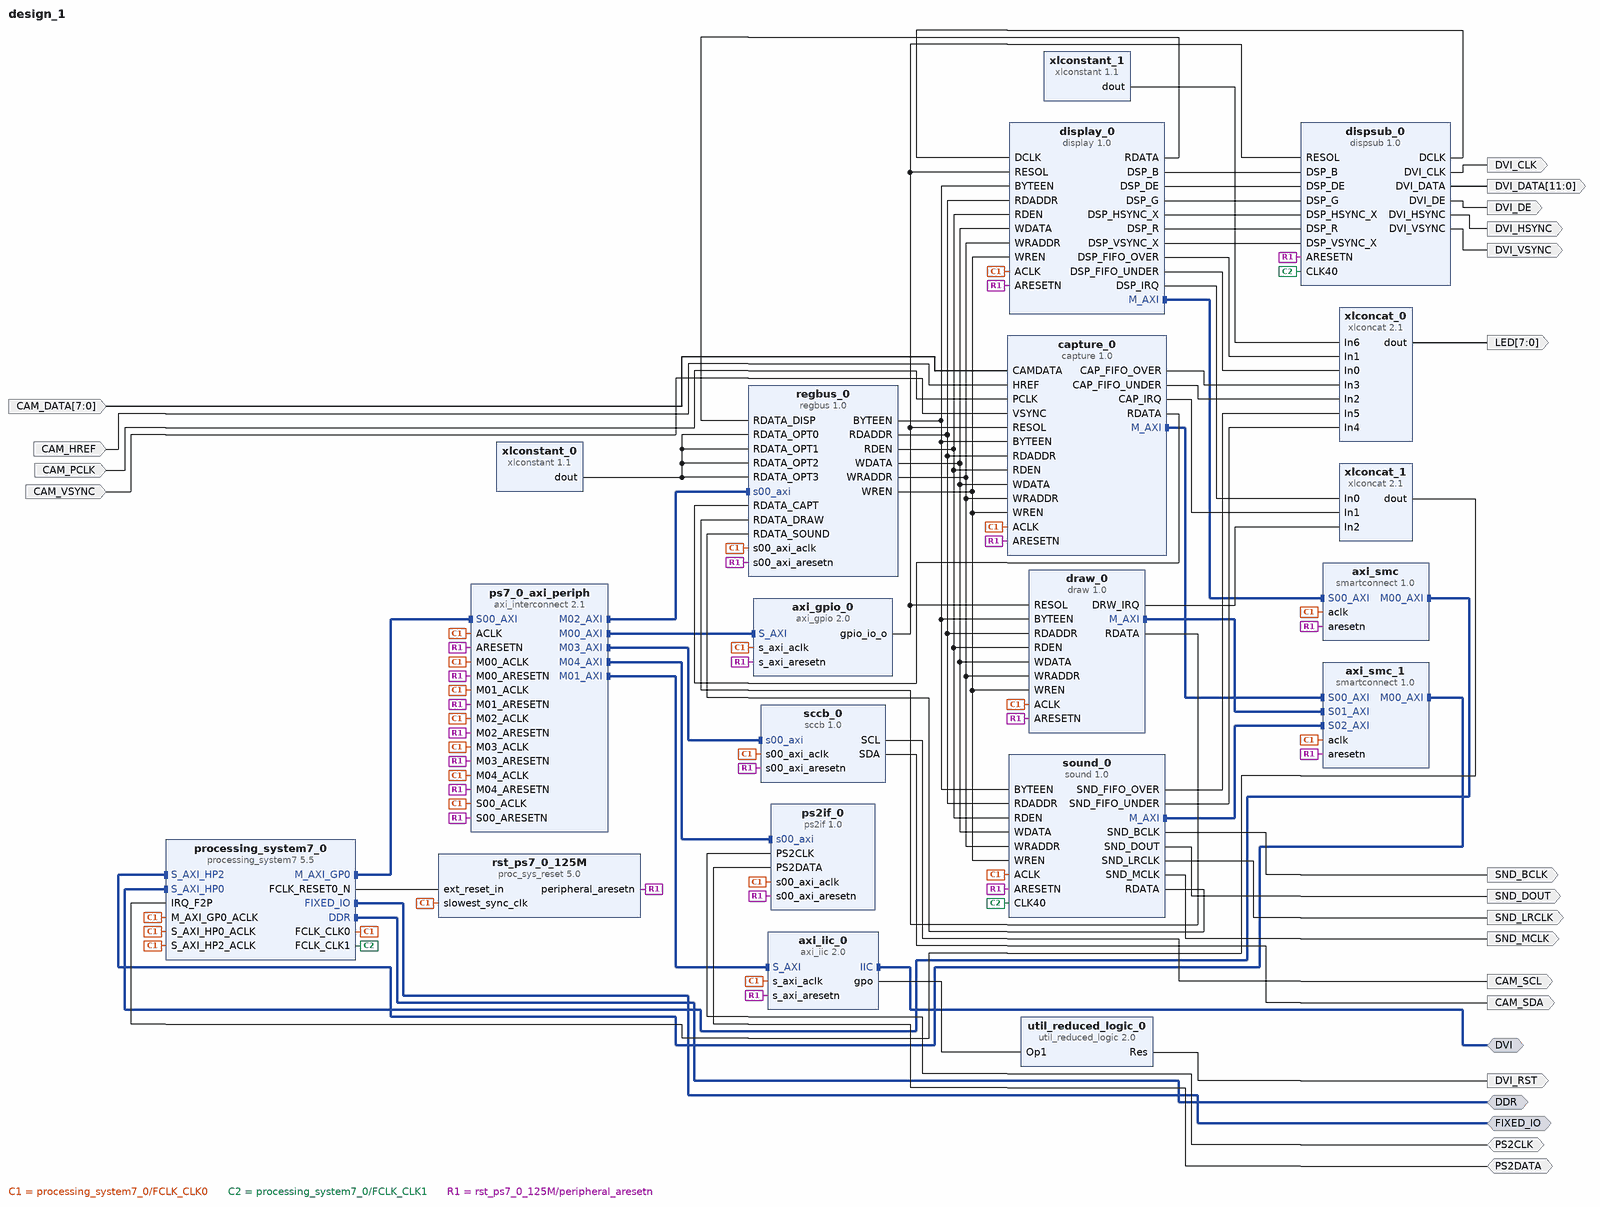
[diagram p0: block diagram of the top level]
# Vivado block design design_1, xc7z020clg484-1, Vivado 2019.1
create_bd_design design_1

create_bd_intf_port -mode Master -vlnv xilinx.com:interface:ddrx_rtl:1.0 DDR
create_bd_intf_port -mode Master -vlnv xilinx.com:interface:iic_rtl:1.0 DVI
create_bd_intf_port -mode Master -vlnv xilinx.com:display_processing_system7:fixedio_rtl:1.0 FIXED_IO
create_bd_port -dir I -from 7 -to 0 CAM_DATA
create_bd_port -dir I CAM_HREF
create_bd_port -dir I CAM_PCLK
create_bd_port -dir O CAM_SCL
create_bd_port -dir O CAM_SDA
create_bd_port -dir I CAM_VSYNC
create_bd_port -dir O DVI_CLK
create_bd_port -dir O -from 11 -to 0 DVI_DATA
create_bd_port -dir O DVI_DE
create_bd_port -dir O DVI_HSYNC
create_bd_port -dir O DVI_RST
create_bd_port -dir O DVI_VSYNC
create_bd_port -dir O -from 7 -to 0 LED
create_bd_port -dir IO PS2CLK
create_bd_port -dir IO PS2DATA
create_bd_port -dir O SND_BCLK
create_bd_port -dir O SND_DOUT
create_bd_port -dir O SND_LRCLK
create_bd_port -dir O SND_MCLK

create_bd_cell -type ip -vlnv xilinx.com:ip:axi_gpio:2.0 axi_gpio_0
set_property -dict {CONFIG.C_ALL_OUTPUTS 1 CONFIG.C_GPIO_WIDTH 2} [get_bd_cells axi_gpio_0]
create_bd_cell -type ip -vlnv xilinx.com:ip:axi_iic:2.0 axi_iic_0
create_bd_cell -type ip -vlnv xilinx.com:ip:smartconnect:1.0 axi_smc
set_property -dict {CONFIG.NUM_SI 1} [get_bd_cells axi_smc]
create_bd_cell -type ip -vlnv xilinx.com:ip:smartconnect:1.0 axi_smc_1
set_property -dict {CONFIG.NUM_SI 3} [get_bd_cells axi_smc_1]
create_bd_cell -type ip -vlnv xilinx.com:user:display:1.0 display_0
create_bd_cell -type ip -vlnv xilinx.com:user:dispsub:1.0 dispsub_0
create_bd_cell -type ip -vlnv xilinx.com:ip:processing_system7:5.5 processing_system7_0
set_property -dict [list \
  CONFIG.PCW_APU_PERIPHERAL_FREQMHZ 666.666666 \
  CONFIG.PCW_CAN0_CAN0_IO {MIO 46 .. 47} \
  CONFIG.PCW_CAN0_PERIPHERAL_ENABLE 1 \
  CONFIG.PCW_CAN_PERIPHERAL_FREQMHZ 23.8095 \
  CONFIG.PCW_ENET0_ENET0_IO {MIO 16 .. 27} \
  CONFIG.PCW_ENET0_GRP_MDIO_ENABLE 1 \
  CONFIG.PCW_ENET0_GRP_MDIO_IO {MIO 52 .. 53} \
  CONFIG.PCW_ENET0_PERIPHERAL_ENABLE 1 \
  CONFIG.PCW_ENET0_PERIPHERAL_FREQMHZ {100 Mbps} \
  CONFIG.PCW_ENET0_RESET_ENABLE 1 \
  CONFIG.PCW_ENET0_RESET_IO {MIO 11} \
  CONFIG.PCW_ENET_RESET_ENABLE 1 \
  CONFIG.PCW_ENET_RESET_SELECT {Share reset pin} \
  CONFIG.PCW_EN_CLK1_PORT 1 \
  CONFIG.PCW_FCLK_CLK1_BUF TRUE \
  CONFIG.PCW_FPGA0_PERIPHERAL_FREQMHZ 125 \
  CONFIG.PCW_FPGA1_PERIPHERAL_FREQMHZ 40 \
  CONFIG.PCW_FPGA_FCLK1_ENABLE 1 \
  CONFIG.PCW_GPIO_MIO_GPIO_ENABLE 1 \
  CONFIG.PCW_GPIO_MIO_GPIO_IO MIO \
  CONFIG.PCW_I2C0_GRP_INT_ENABLE 0 \
  CONFIG.PCW_I2C0_I2C0_IO {MIO 50 .. 51} \
  CONFIG.PCW_I2C0_PERIPHERAL_ENABLE 1 \
  CONFIG.PCW_I2C0_RESET_ENABLE 1 \
  CONFIG.PCW_I2C0_RESET_IO {MIO 13} \
  CONFIG.PCW_I2C_PERIPHERAL_FREQMHZ 111.111115 \
  CONFIG.PCW_I2C_RESET_ENABLE 1 \
  CONFIG.PCW_I2C_RESET_SELECT {Share reset pin} \
  CONFIG.PCW_IRQ_F2P_INTR 1 \
  CONFIG.PCW_PRESET_BANK0_VOLTAGE {LVCMOS 1.8V} \
  CONFIG.PCW_PRESET_BANK1_VOLTAGE {LVCMOS 1.8V} \
  CONFIG.PCW_QSPI_GRP_FBCLK_ENABLE 1 \
  CONFIG.PCW_QSPI_GRP_FBCLK_IO {MIO 8} \
  CONFIG.PCW_QSPI_GRP_SINGLE_SS_ENABLE 1 \
  CONFIG.PCW_QSPI_GRP_SINGLE_SS_IO {MIO 1 .. 6} \
  CONFIG.PCW_QSPI_PERIPHERAL_ENABLE 1 \
  CONFIG.PCW_QSPI_QSPI_IO {MIO 1 .. 6} \
  CONFIG.PCW_SD0_GRP_CD_ENABLE 1 \
  CONFIG.PCW_SD0_GRP_CD_IO {MIO 0} \
  CONFIG.PCW_SD0_GRP_WP_ENABLE 1 \
  CONFIG.PCW_SD0_GRP_WP_IO {MIO 15} \
  CONFIG.PCW_SD0_PERIPHERAL_ENABLE 1 \
  CONFIG.PCW_SD0_SD0_IO {MIO 40 .. 45} \
  CONFIG.PCW_SDIO_PERIPHERAL_FREQMHZ 50 \
  CONFIG.PCW_SINGLE_QSPI_DATA_MODE x4 \
  CONFIG.PCW_TTC0_PERIPHERAL_ENABLE 1 \
  CONFIG.PCW_TTC0_TTC0_IO EMIO \
  CONFIG.PCW_UART1_PERIPHERAL_ENABLE 1 \
  CONFIG.PCW_UART1_UART1_IO {MIO 48 .. 49} \
  CONFIG.PCW_UART_PERIPHERAL_FREQMHZ 50 \
  CONFIG.PCW_UIPARAM_DDR_FREQ_MHZ 533.333333 \
  CONFIG.PCW_UIPARAM_DDR_PARTNO {MT41J256M8 HX-15E} \
  CONFIG.PCW_USB0_PERIPHERAL_ENABLE 1 \
  CONFIG.PCW_USB0_RESET_ENABLE 1 \
  CONFIG.PCW_USB0_RESET_IO {MIO 7} \
  CONFIG.PCW_USB0_USB0_IO {MIO 28 .. 39} \
  CONFIG.PCW_USB_RESET_ENABLE 1 \
  CONFIG.PCW_USB_RESET_SELECT {Share reset pin} \
  CONFIG.PCW_USE_FABRIC_INTERRUPT 1 \
  CONFIG.PCW_USE_S_AXI_HP0 1 \
  CONFIG.PCW_USE_S_AXI_HP2 1 \
  CONFIG.preset ZC702 \
] [get_bd_cells processing_system7_0]
# 222 more settings of processing_system7_0 are not shown: defaults, MIO pin electricals, DDR timing, and values the tool derives
create_bd_cell -type ip -vlnv xilinx.com:user:ps2if:1.0 ps2if_0
create_bd_cell -type ip -vlnv xilinx.com:ip:axi_interconnect:2.1 ps7_0_axi_periph
set_property -dict {CONFIG.NUM_MI 5} [get_bd_cells ps7_0_axi_periph]
create_bd_cell -type ip -vlnv xilinx.com:user:regbus:1.0 regbus_0
create_bd_cell -type ip -vlnv xilinx.com:ip:proc_sys_reset:5.0 rst_ps7_0_125M
create_bd_cell -type ip -vlnv xilinx.com:user:sccb:1.0 sccb_0
create_bd_cell -type ip -vlnv xilinx.com:ip:util_reduced_logic:2.0 util_reduced_logic_0
set_property -dict {CONFIG.C_SIZE 1} [get_bd_cells util_reduced_logic_0]
create_bd_cell -type ip -vlnv xilinx.com:ip:xlconcat:2.1 xlconcat_0
set_property -dict {CONFIG.IN4_WIDTH 1 CONFIG.IN6_WIDTH 2 CONFIG.NUM_PORTS 7} [get_bd_cells xlconcat_0]
create_bd_cell -type ip -vlnv xilinx.com:ip:xlconcat:2.1 xlconcat_1
set_property -dict {CONFIG.NUM_PORTS 3} [get_bd_cells xlconcat_1]
create_bd_cell -type ip -vlnv xilinx.com:ip:xlconstant:1.1 xlconstant_0
set_property -dict {CONFIG.CONST_VAL 0 CONFIG.CONST_WIDTH 32} [get_bd_cells xlconstant_0]
create_bd_cell -type ip -vlnv xilinx.com:ip:xlconstant:1.1 xlconstant_1
set_property -dict {CONFIG.CONST_VAL 0 CONFIG.CONST_WIDTH 2} [get_bd_cells xlconstant_1]
create_bd_cell -type ip -vlnv xilinx.com:user:capture:1.0 capture_0
create_bd_cell -type ip -vlnv xilinx.com:user:sound:1.0 sound_0
create_bd_cell -type ip -vlnv xilinx.com:user:draw:1.0 draw_0

# ---- connections ----

connect_bd_intf_net [get_bd_intf_pins ps2if_0/s00_axi] [get_bd_intf_pins ps7_0_axi_periph/M04_AXI]
connect_bd_intf_net [get_bd_intf_ports DVI] [get_bd_intf_pins axi_iic_0/IIC]
connect_bd_intf_net [get_bd_intf_pins axi_smc_1/S00_AXI] [get_bd_intf_pins capture_0/M_AXI]
connect_bd_intf_net [get_bd_intf_ports FIXED_IO] [get_bd_intf_pins processing_system7_0/FIXED_IO]
connect_bd_intf_net [get_bd_intf_pins ps7_0_axi_periph/M02_AXI] [get_bd_intf_pins regbus_0/s00_axi]
connect_bd_intf_net [get_bd_intf_pins processing_system7_0/M_AXI_GP0] [get_bd_intf_pins ps7_0_axi_periph/S00_AXI]
connect_bd_intf_net [get_bd_intf_pins axi_smc_1/M00_AXI] [get_bd_intf_pins processing_system7_0/S_AXI_HP2]
connect_bd_intf_net [get_bd_intf_pins ps7_0_axi_periph/M03_AXI] [get_bd_intf_pins sccb_0/s00_axi]
connect_bd_intf_net [get_bd_intf_ports DDR] [get_bd_intf_pins processing_system7_0/DDR]
connect_bd_intf_net [get_bd_intf_pins axi_smc/S00_AXI] [get_bd_intf_pins display_0/M_AXI]
connect_bd_intf_net [get_bd_intf_pins axi_smc/M00_AXI] [get_bd_intf_pins processing_system7_0/S_AXI_HP0]
connect_bd_intf_net [get_bd_intf_pins axi_smc_1/S02_AXI] [get_bd_intf_pins sound_0/M_AXI]
connect_bd_intf_net [get_bd_intf_pins axi_gpio_0/S_AXI] [get_bd_intf_pins ps7_0_axi_periph/M00_AXI]
connect_bd_intf_net [get_bd_intf_pins axi_smc_1/S01_AXI] [get_bd_intf_pins draw_0/M_AXI]
connect_bd_intf_net [get_bd_intf_pins axi_iic_0/S_AXI] [get_bd_intf_pins ps7_0_axi_periph/M01_AXI]
connect_bd_net -net CAMDATA_0_1 [get_bd_ports CAM_DATA] [get_bd_pins capture_0/CAMDATA]
connect_bd_net -net HREF_0_1 [get_bd_ports CAM_HREF] [get_bd_pins capture_0/HREF]
connect_bd_net [get_bd_ports PS2CLK] [get_bd_pins ps2if_0/PS2CLK]
connect_bd_net [get_bd_ports PS2DATA] [get_bd_pins ps2if_0/PS2DATA]
connect_bd_net -net PCLK_0_1 [get_bd_ports CAM_PCLK] [get_bd_pins capture_0/PCLK]
connect_bd_net -net VSYNC_0_1 [get_bd_ports CAM_VSYNC] [get_bd_pins capture_0/VSYNC]
connect_bd_net [get_bd_pins axi_gpio_0/gpio_io_o] \
  [get_bd_pins display_0/RESOL] [get_bd_pins dispsub_0/RESOL] [get_bd_pins capture_0/RESOL] [get_bd_pins draw_0/RESOL]
connect_bd_net [get_bd_pins axi_iic_0/gpo] [get_bd_pins util_reduced_logic_0/Op1]
connect_bd_net [get_bd_pins capture_0/CAP_FIFO_OVER] [get_bd_pins xlconcat_0/In3]
connect_bd_net [get_bd_pins capture_0/CAP_FIFO_UNDER] [get_bd_pins xlconcat_0/In2]
connect_bd_net [get_bd_pins capture_0/CAP_IRQ] [get_bd_pins xlconcat_1/In1]
connect_bd_net [get_bd_pins capture_0/RDATA] [get_bd_pins regbus_0/RDATA_CAPT]
connect_bd_net [get_bd_pins display_0/DSP_B] [get_bd_pins dispsub_0/DSP_B]
connect_bd_net [get_bd_pins display_0/DSP_DE] [get_bd_pins dispsub_0/DSP_DE]
connect_bd_net [get_bd_pins display_0/DSP_FIFO_OVER] [get_bd_pins xlconcat_0/In1]
connect_bd_net [get_bd_pins display_0/DSP_FIFO_UNDER] [get_bd_pins xlconcat_0/In0]
connect_bd_net [get_bd_pins display_0/DSP_G] [get_bd_pins dispsub_0/DSP_G]
connect_bd_net [get_bd_pins display_0/DSP_HSYNC_X] [get_bd_pins dispsub_0/DSP_HSYNC_X]
connect_bd_net [get_bd_pins display_0/DSP_IRQ] [get_bd_pins xlconcat_1/In0]
connect_bd_net [get_bd_pins display_0/DSP_R] [get_bd_pins dispsub_0/DSP_R]
connect_bd_net [get_bd_pins display_0/DSP_VSYNC_X] [get_bd_pins dispsub_0/DSP_VSYNC_X]
connect_bd_net [get_bd_pins display_0/RDATA] [get_bd_pins regbus_0/RDATA_DISP]
connect_bd_net [get_bd_pins dispsub_0/DCLK] [get_bd_pins display_0/DCLK]
connect_bd_net [get_bd_pins dispsub_0/DVI_CLK] [get_bd_ports DVI_CLK]
connect_bd_net [get_bd_pins dispsub_0/DVI_DATA] [get_bd_ports DVI_DATA]
connect_bd_net [get_bd_pins dispsub_0/DVI_DE] [get_bd_ports DVI_DE]
connect_bd_net [get_bd_pins dispsub_0/DVI_HSYNC] [get_bd_ports DVI_HSYNC]
connect_bd_net [get_bd_pins dispsub_0/DVI_VSYNC] [get_bd_ports DVI_VSYNC]
connect_bd_net [get_bd_pins draw_0/DRW_IRQ] [get_bd_pins xlconcat_1/In2]
connect_bd_net [get_bd_pins draw_0/RDATA] [get_bd_pins regbus_0/RDATA_DRAW]
connect_bd_net [get_bd_pins processing_system7_0/FCLK_CLK0] \
  [get_bd_pins axi_gpio_0/s_axi_aclk] [get_bd_pins axi_iic_0/s_axi_aclk] [get_bd_pins axi_smc/aclk] \
  [get_bd_pins axi_smc_1/aclk] [get_bd_pins display_0/ACLK] [get_bd_pins processing_system7_0/M_AXI_GP0_ACLK] \
  [get_bd_pins processing_system7_0/S_AXI_HP0_ACLK] [get_bd_pins processing_system7_0/S_AXI_HP2_ACLK] \
  [get_bd_pins ps2if_0/s00_axi_aclk] [get_bd_pins ps7_0_axi_periph/ACLK] [get_bd_pins ps7_0_axi_periph/M00_ACLK] \
  [get_bd_pins ps7_0_axi_periph/M01_ACLK] [get_bd_pins ps7_0_axi_periph/M02_ACLK] [get_bd_pins ps7_0_axi_periph/M03_ACLK] \
  [get_bd_pins ps7_0_axi_periph/M04_ACLK] [get_bd_pins ps7_0_axi_periph/S00_ACLK] [get_bd_pins regbus_0/s00_axi_aclk] \
  [get_bd_pins rst_ps7_0_125M/slowest_sync_clk] [get_bd_pins sccb_0/s00_axi_aclk] [get_bd_pins capture_0/ACLK] \
  [get_bd_pins sound_0/ACLK] [get_bd_pins draw_0/ACLK]
connect_bd_net [get_bd_pins processing_system7_0/FCLK_CLK1] [get_bd_pins dispsub_0/CLK40] [get_bd_pins sound_0/CLK40]
connect_bd_net [get_bd_pins processing_system7_0/FCLK_RESET0_N] [get_bd_pins rst_ps7_0_125M/ext_reset_in]
connect_bd_net [get_bd_pins regbus_0/BYTEEN] \
  [get_bd_pins display_0/BYTEEN] [get_bd_pins capture_0/BYTEEN] [get_bd_pins sound_0/BYTEEN] [get_bd_pins draw_0/BYTEEN]
connect_bd_net [get_bd_pins regbus_0/RDADDR] \
  [get_bd_pins display_0/RDADDR] [get_bd_pins capture_0/RDADDR] [get_bd_pins sound_0/RDADDR] [get_bd_pins draw_0/RDADDR]
connect_bd_net [get_bd_pins regbus_0/RDEN] \
  [get_bd_pins display_0/RDEN] [get_bd_pins capture_0/RDEN] [get_bd_pins sound_0/RDEN] [get_bd_pins draw_0/RDEN]
connect_bd_net [get_bd_pins regbus_0/WDATA] \
  [get_bd_pins display_0/WDATA] [get_bd_pins capture_0/WDATA] [get_bd_pins sound_0/WDATA] [get_bd_pins draw_0/WDATA]
connect_bd_net [get_bd_pins regbus_0/WRADDR] \
  [get_bd_pins display_0/WRADDR] [get_bd_pins capture_0/WRADDR] [get_bd_pins sound_0/WRADDR] [get_bd_pins draw_0/WRADDR]
connect_bd_net [get_bd_pins regbus_0/WREN] \
  [get_bd_pins display_0/WREN] [get_bd_pins capture_0/WREN] [get_bd_pins sound_0/WREN] [get_bd_pins draw_0/WREN]
connect_bd_net [get_bd_pins rst_ps7_0_125M/peripheral_aresetn] \
  [get_bd_pins axi_gpio_0/s_axi_aresetn] [get_bd_pins axi_iic_0/s_axi_aresetn] [get_bd_pins axi_smc/aresetn] \
  [get_bd_pins axi_smc_1/aresetn] [get_bd_pins display_0/ARESETN] [get_bd_pins dispsub_0/ARESETN] \
  [get_bd_pins ps2if_0/s00_axi_aresetn] [get_bd_pins ps7_0_axi_periph/ARESETN] [get_bd_pins ps7_0_axi_periph/M00_ARESETN] \
  [get_bd_pins ps7_0_axi_periph/M01_ARESETN] [get_bd_pins ps7_0_axi_periph/M02_ARESETN] \
  [get_bd_pins ps7_0_axi_periph/M03_ARESETN] [get_bd_pins ps7_0_axi_periph/M04_ARESETN] \
  [get_bd_pins ps7_0_axi_periph/S00_ARESETN] [get_bd_pins regbus_0/s00_axi_aresetn] [get_bd_pins sccb_0/s00_axi_aresetn] \
  [get_bd_pins capture_0/ARESETN] [get_bd_pins sound_0/ARESETN] [get_bd_pins draw_0/ARESETN]
connect_bd_net [get_bd_pins sccb_0/SCL] [get_bd_ports CAM_SCL]
connect_bd_net [get_bd_pins sccb_0/SDA] [get_bd_ports CAM_SDA]
connect_bd_net [get_bd_pins sound_0/RDATA] [get_bd_pins regbus_0/RDATA_SOUND]
connect_bd_net [get_bd_pins sound_0/SND_BCLK] [get_bd_ports SND_BCLK]
connect_bd_net [get_bd_pins sound_0/SND_DOUT] [get_bd_ports SND_DOUT]
connect_bd_net [get_bd_pins sound_0/SND_FIFO_OVER] [get_bd_pins xlconcat_0/In5]
connect_bd_net [get_bd_pins sound_0/SND_FIFO_UNDER] [get_bd_pins xlconcat_0/In4]
connect_bd_net [get_bd_pins sound_0/SND_LRCLK] [get_bd_ports SND_LRCLK]
connect_bd_net [get_bd_pins sound_0/SND_MCLK] [get_bd_ports SND_MCLK]
connect_bd_net [get_bd_pins util_reduced_logic_0/Res] [get_bd_ports DVI_RST]
connect_bd_net [get_bd_pins xlconcat_0/dout] [get_bd_ports LED]
connect_bd_net [get_bd_pins xlconcat_1/dout] [get_bd_pins processing_system7_0/IRQ_F2P]
connect_bd_net [get_bd_pins xlconstant_0/dout] \
  [get_bd_pins regbus_0/RDATA_OPT0] [get_bd_pins regbus_0/RDATA_OPT1] [get_bd_pins regbus_0/RDATA_OPT2] \
  [get_bd_pins regbus_0/RDATA_OPT3]
connect_bd_net [get_bd_pins xlconstant_1/dout] [get_bd_pins xlconcat_0/In6]

# ---- address map ----
assign_bd_address -offset 0x00000000 -range 1G -target_address_space [get_bd_addr_spaces capture_0/M_AXI] [get_bd_addr_segs processing_system7_0/S_AXI_HP2/HP2_DDR_LOWOCM]
assign_bd_address -offset 0x00000000 -range 1G -target_address_space [get_bd_addr_spaces display_0/M_AXI] [get_bd_addr_segs processing_system7_0/S_AXI_HP0/HP0_DDR_LOWOCM]
assign_bd_address -offset 0x00000000 -range 1G -target_address_space [get_bd_addr_spaces draw_0/M_AXI] [get_bd_addr_segs processing_system7_0/S_AXI_HP2/HP2_DDR_LOWOCM]
assign_bd_address -offset 0x41200000 -range 64K -target_address_space [get_bd_addr_spaces processing_system7_0/Data] [get_bd_addr_segs axi_gpio_0/S_AXI/Reg]
assign_bd_address -offset 0x41600000 -range 64K -target_address_space [get_bd_addr_spaces processing_system7_0/Data] [get_bd_addr_segs axi_iic_0/S_AXI/Reg]
assign_bd_address -offset 0x43C00000 -range 64K -target_address_space [get_bd_addr_spaces processing_system7_0/Data] [get_bd_addr_segs regbus_0/s00_axi/reg0]
assign_bd_address -offset 0x43C10000 -range 64K -target_address_space [get_bd_addr_spaces processing_system7_0/Data] [get_bd_addr_segs sccb_0/s00_axi/reg0]
assign_bd_address -offset 0x43C20000 -range 64K -target_address_space [get_bd_addr_spaces processing_system7_0/Data] [get_bd_addr_segs ps2if_0/s00_axi/reg0]
assign_bd_address -offset 0x00000000 -range 1G -target_address_space [get_bd_addr_spaces sound_0/M_AXI] [get_bd_addr_segs processing_system7_0/S_AXI_HP2/HP2_DDR_LOWOCM]

validate_bd_design
save_bd_design
